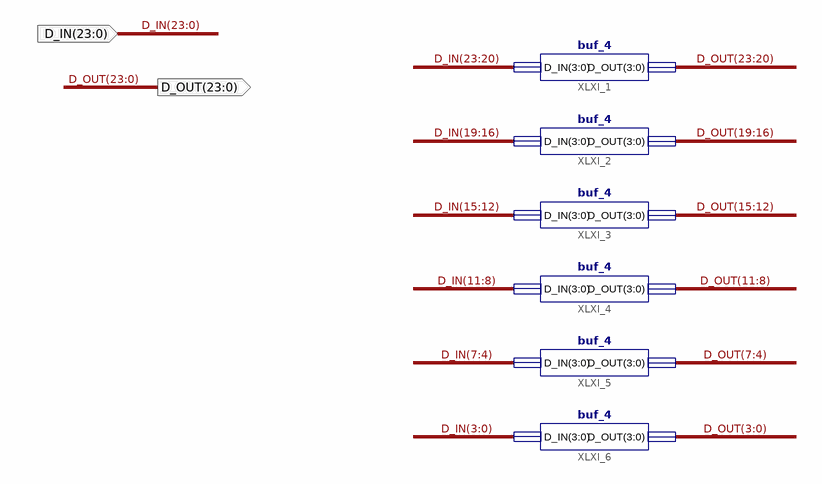
[diagram p0: schematic sheet 1]
// Xilinx ISE schematic buf_24.sch (artix7) as structural Verilog: 6 symbols, 2 ports
module buf_24 (
  input  [23:0] D_IN,
  output [23:0] D_OUT
);

  buf_4 XLXI_1 (.D_IN(D_IN[23:20]), .D_OUT(D_OUT[23:20]));
  buf_4 XLXI_2 (.D_IN(D_IN[19:16]), .D_OUT(D_OUT[19:16]));
  buf_4 XLXI_3 (.D_IN(D_IN[15:12]), .D_OUT(D_OUT[15:12]));
  buf_4 XLXI_4 (.D_IN(D_IN[11:8]), .D_OUT(D_OUT[11:8]));
  buf_4 XLXI_5 (.D_IN(D_IN[7:4]), .D_OUT(D_OUT[7:4]));
  buf_4 XLXI_6 (.D_IN(D_IN[3:0]), .D_OUT(D_OUT[3:0]));
endmodule
